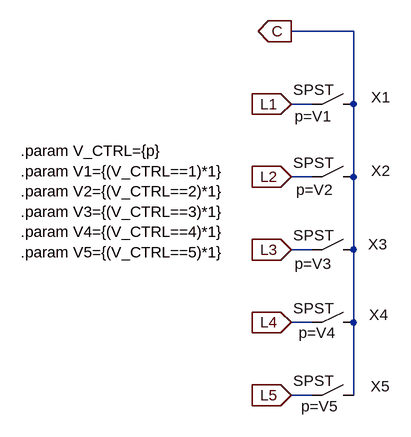
[diagram p0: schematic 5_way_BaseSwitch.asc]
5_way_BaseSwitch.asc, the LTspice schematic file:
Version 4
SHEET 1 1060 1428
WIRE 256 64 160 64
WIRE 192 176 160 176
WIRE 256 176 256 64
WIRE 192 288 160 288
WIRE 256 288 256 176
WIRE 192 400 160 400
WIRE 256 400 256 288
WIRE 192 512 160 512
WIRE 256 512 256 400
WIRE 192 624 160 624
WIRE 256 624 256 512
FLAG 160 176 L1
IOPIN 160 176 In
FLAG 160 288 L2
IOPIN 160 288 In
FLAG 160 400 L3
IOPIN 160 400 In
FLAG 160 512 L4
IOPIN 160 512 In
FLAG 160 624 L5
IOPIN 160 624 In
FLAG 160 64 C
IOPIN 160 64 Out
SYMBOL SPST 224 176 R0
WINDOW 39 -30 19 Center 2
WINDOW 0 74 5 Bottom 2
SYMATTR SpiceLine p=V1
SYMATTR InstName X1
SYMBOL SPST 224 288 R0
WINDOW 39 -28 20 Center 2
WINDOW 0 74 6 Bottom 2
SYMATTR SpiceLine p=V2
SYMATTR InstName X2
SYMBOL SPST 224 400 R0
WINDOW 39 -30 22 Center 2
WINDOW 0 69 7 Bottom 2
SYMATTR SpiceLine p=V3
SYMATTR InstName X3
SYMBOL SPST 224 512 R0
WINDOW 39 -24 16 Center 2
WINDOW 0 71 4 Bottom 2
SYMATTR SpiceLine p=V4
SYMATTR InstName X4
SYMBOL SPST 224 624 R0
WINDOW 39 -20 17 Center 2
WINDOW 0 73 2 Bottom 2
SYMATTR SpiceLine p=V5
SYMATTR InstName X5
TEXT -256 248 Left 2 !.param V_CTRL={p}\n.param V1={(V_CTRL==1)*1}\n.param V2={(V_CTRL==2)*1}\n.param V3={(V_CTRL==3)*1}\n.param V4={(V_CTRL==4)*1}\n.param V5={(V_CTRL==5)*1}

The netlist it stands for:
* 5_way_BaseSwitch.asc
XX1 L1 C SPST p=V1  ; pins In Out
XX2 L2 C SPST p=V2  ; pins In Out
XX3 L3 C SPST p=V3  ; pins In Out
XX4 L4 C SPST p=V4  ; pins In Out
XX5 L5 C SPST p=V5  ; pins In Out
.param V_CTRL={p}
.param V1={(V_CTRL==1)*1}
.param V2={(V_CTRL==2)*1}
.param V3={(V_CTRL==3)*1}
.param V4={(V_CTRL==4)*1}
.param V5={(V_CTRL==5)*1}
.backanno
.end